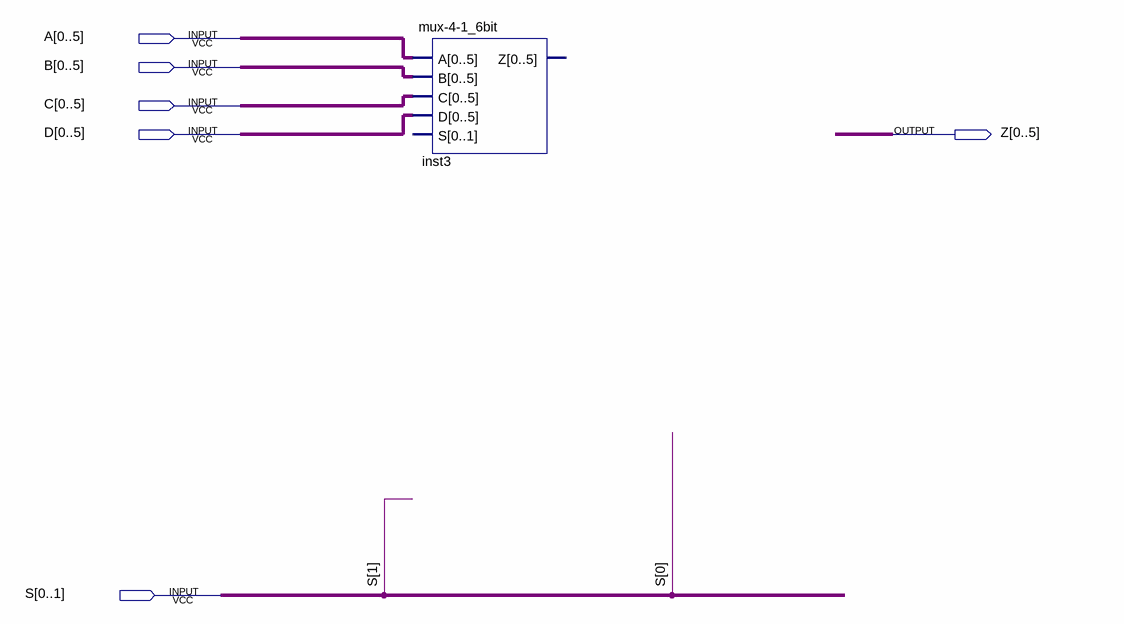
[diagram p0: schematic sheet]
// Quartus schematic mux-8-1_6bit.bdf as structural Verilog: 1 symbols, 6 pins
module \mux-8-1_6bit  (
  input  [0:5] A,
  input  [0:5] B,
  input  [0:5] C,
  input  [0:5] D,
  input  [0:1] S,
  output [0:5] Z
);

  \mux-4-1_6bit  inst3 (.A(A), .B(B), .C(C), .D(D));  // open: S, Z
endmodule
